# Altium schematic sheet MOTOR_CUR_SENS.SchDoc
size A; SheetNumber: 4; SheetTotal: 6
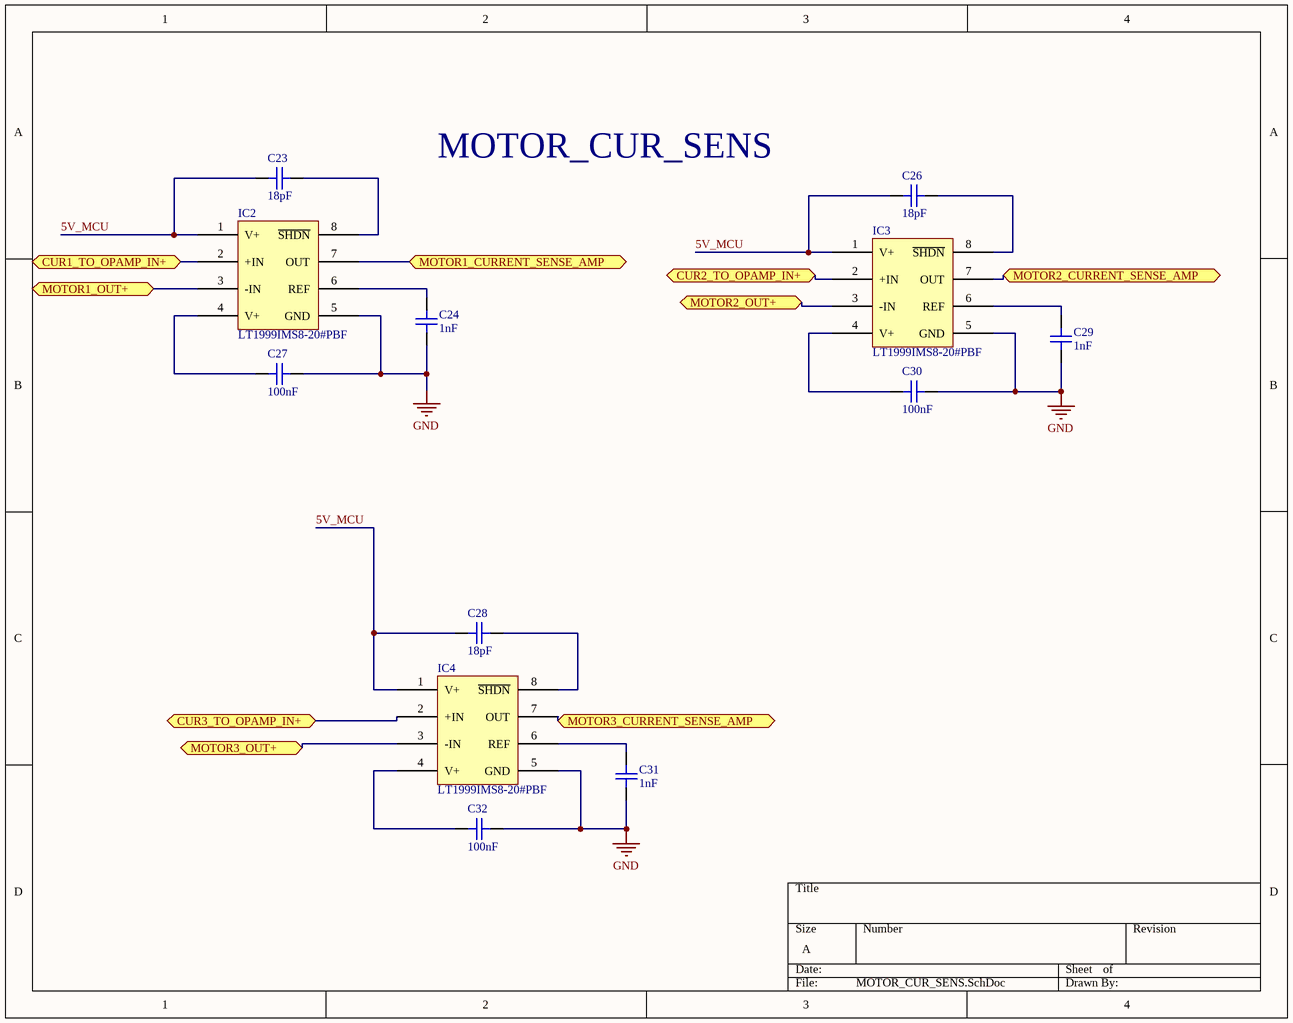
[diagram p0: MOTOR_CUR_SENS.SchDoc]

## Parts
C23  18pF  [CAP_ADJ_0805]
C24  1nF  [CAP_ADJ_0805]
C26  18pF  [CAP_ADJ_0805]
C27  100nF  [CAP_ADJ_0805]
C28  18pF  [CAP_ADJ_0805]
C29  1nF  [CAP_ADJ_0805]
C30  100nF  [CAP_ADJ_0805]
C31  1nF  [CAP_ADJ_0805]
C32  100nF  [CAP_ADJ_0805]
IC2  LT1999IMS8-20#PBF  [LT1999IMS8-20#PBF-ND]
IC3  LT1999IMS8-20#PBF  [LT1999IMS8-20#PBF-ND]
IC4  LT1999IMS8-20#PBF  [LT1999IMS8-20#PBF-ND]

## Ports
CUR1_TO_OPAMP_IN+ (bidir), CUR2_TO_OPAMP_IN+ (bidir), CUR3_TO_OPAMP_IN+ (bidir), MOTOR1_CURRENT_SENSE_AMP (bidir), MOTOR1_OUT+ (bidir), MOTOR2_CURRENT_SENSE_AMP (bidir), MOTOR2_OUT+ (bidir), MOTOR3_CURRENT_SENSE_AMP (bidir), MOTOR3_OUT+ (bidir)

## Nets
GND: C24.1 C27.1 C29.1 C30.1 C31.1 C32.1 IC2.5(GND) IC3.5(GND) IC4.5(GND)
5V_MCU: C23.2 C26.2 C28.2 IC2.1(V+) IC3.1(V+) IC4.1(V+)
CUR1_TO_OPAMP_IN+: IC2.2(+IN) ; port CUR1_TO_OPAMP_IN+
CUR2_TO_OPAMP_IN+: IC3.2(+IN) ; port CUR2_TO_OPAMP_IN+
CUR3_TO_OPAMP_IN+: IC4.2(+IN) ; port CUR3_TO_OPAMP_IN+
MOTOR1_CURRENT_SENSE_AMP: IC2.7(OUT) ; port MOTOR1_CURRENT_SENSE_AMP
MOTOR1_OUT+: IC2.3(-IN) ; port MOTOR1_OUT+
MOTOR2_CURRENT_SENSE_AMP: IC3.7(OUT) ; port MOTOR2_CURRENT_SENSE_AMP
MOTOR2_OUT+: IC3.3(-IN) ; port MOTOR2_OUT+
MOTOR3_CURRENT_SENSE_AMP: IC4.7(OUT) ; port MOTOR3_CURRENT_SENSE_AMP
MOTOR3_OUT+: IC4.3(-IN) ; port MOTOR3_OUT+
NetC23_1: C23.1 IC2.8(~{SHDN})
NetC24_2: C24.2 IC2.6(REF)
NetC26_1: C26.1 IC3.8(~{SHDN})
NetC27_2: C27.2 IC2.4(V+)
NetC28_1: C28.1 IC4.8(~{SHDN})
NetC29_2: C29.2 IC3.6(REF)
NetC30_2: C30.2 IC3.4(V+)
NetC31_2: C31.2 IC4.6(REF)
NetC32_2: C32.2 IC4.4(V+)

## Notes on the sheet
- MOTOR_CUR_SENS

## Library data of the parts
C23 C26 C28 = CAP_ADJ_0805: CERAMIC CAPACITOR SMD 0805; Manufacturer: Yageo; Manufacturer Part Number: CC0805FRNPO9BN180; Tolerance: 1%; Voltage Rating (DC): 50V; Dielectric: C0G; Supplier 1: Digi-Key; Supplier Part Number 1: 311-4168-1-ND; Stock 1: 0; Pricing 1: 1=0.24, 10=0.172, 100=0.0808, 500=0.0566, 1000=0.0469 (USD); Mount: Surface Mount; Case/Package: 0805; Weight: 0.000194oz; Case Code (Imperial): 0805; Case Code (Metric): 2012; Min Operating Temperature: -55°C; Max Operating Temperature: 125°C; Capacitance: 18pF; Packaging: Tape and Reel; Voltage Rating: 50V; Termination: SMD/SMT; Composition: Ceramic; Length: 2mm; Height: 0.6mm; Width: 0.049inch; Thickness: 0.028inch; Depth: 1.25mm; Radiation Hardening: No; Lead Free: Lead Free; ComponentLink1URL: https://datasheet.ciiva.com/17436/upy-gp-np0-16v-to-50v-8-17436806.pdf; ComponentLink1Description: https://datasheet.ciiva.com/17436/upy-gp-np0-16v-to-50v-8-17436806.pdf; ComponentLink2URL: https://datasheet.ciiva.com/13209/upy-gp-np0-16v-to-50v-8-13209403.pdf; ComponentLink2Description: https://datasheet.ciiva.com/13209/upy-gp-np0-16v-to-50v-8-13209403.pdf; ComponentLink3URL: https://datasheet.ciiva.com/11465/upy-gp-np0-16v-to-50v-8-11465132.pdf; ComponentLink3Description: https://datasheet.ciiva.com/11465/upy-gp-np0-16v-to-50v-8-11465132.pdf
C24 C29 C31 = CAP_ADJ_0805: CERAMIC CAPACITOR SMD 0805; Manufacturer: KEMET; Manufacturer Part Number: C0805C102K4RACTU; Voltage Rating: 16V; Tolerance: 10%; Dielectric: X7R; Dissipation Factor: 5%; Supplier 1: Digi-Key; Supplier Part Number 1: 399-7987-1-ND; Stock 1: 41262; Pricing 1: 1=0.1, 10=0.07, 100=0.031, 500=0.0221, 1000=0.0174 (USD); Mount: Surface Mount; Case/Package: 0805; Case Code (Metric): 2012; Case Code (Imperial): 0805; Dielectric Material: Ceramic; Min Operating Temperature: -55°C; Max Operating Temperature: 125°C; Package Quantity: 1; Capacitance: 1nF; Packaging: Tape and Reel; Voltage Rating (DC): 16V; Termination: SMD/SMT; Length: 0.079inch; Height: 0.78mm; Width: 0.049inch; Thickness: 0.035inch; Lead Pitch: 0.75mm; REACH SVHC: No SVHC; ComponentLink1URL: http://www.mouser.com/ds/2/212/KEM_C1002_X7R_SMD-1102033.pdf; ComponentLink1Description: http://www.mouser.com/ds/2/212/KEM_C1002_X7R_SMD-1102033.pdf; ComponentLink2URL: https://search.kemet.com/component-edge/download/datasheet/C0805C102K4RACTU.pdf; ComponentLink2Description: https://search.kemet.com/component-edge/download/datasheet/C0805C102K4RACTU.pdf; ComponentLink3URL: http://capacitoredge.kemet.com/capedge2/DataSheet?pn=C0805C102K4RACTU; ComponentLink3Description: http://capacitoredge.kemet.com/capedge2/DataSheet?pn=C0805C102K4RACTU
C27 C30 C32 = CAP_ADJ_0805: CERAMIC CAPACITOR SMD 0805; Manufacturer: KEMET; Manufacturer Part Number: C0805C104J5RACAUTO; Voltage Rating: 50V; Tolerance: 5%; Dielectric: X7R; Supplier 1: Digi-Key; Supplier Part Number 1: 399-6925-1-ND; Stock 1: 9661; Pricing 1: 1=0.22, 10=0.152, 100=0.0769, 500=0.0526, 1000=0.0466 (USD); Mount: Surface Mount; Case/Package: 0805; Case Code (Metric): 2012; Case Code (Imperial): 0805; Dielectric Material: Ceramic; Min Operating Temperature: -55°C; Max Operating Temperature: 125°C; Package Quantity: 1; Capacitance: 100nF; Packaging: Cut Tape; Voltage Rating (DC): 50V; Length: 0.079inch; Width: 0.049inch; Thickness: 0.035inch; Depth: 1.25mm; REACH SVHC: No SVHC; ComponentLink1URL: http://components.arrow.com/part/dataview/0323_00324161; ComponentLink1Description: http://components.arrow.com/part/dataview/0323_00324161; ComponentLink2URL: http://www.farnell.com/datasheets/2123421.pdf; ComponentLink2Description: http://www.farnell.com/datasheets/2123421.pdf; ComponentLink3URL: https://search.kemet.com/component-edge/download/datasheet/C0805C104J5RACAUTO.pdf; ComponentLink3Description: https://search.kemet.com/component-edge/download/datasheet/C0805C104J5RACAUTO.pdf
IC2-IC4 = LT1999IMS8-20#PBF: IC OPAMP CURR SENSE 2MHZ 8MSOP; Manufacturer: Analog Devices / Linear Technology; Nominal Supply Current: 5.8mA; Common Mode Rejection Ratio: 75dB; Number of Channels: 1; Max Supply Voltage: 5.5V; Min Supply Voltage: 4.5V; Operating Supply Voltage: 5V; Slew Rate: 3V/µs; Input Bias Current: 137.5uA; Input Offset Voltage (Vos): 1.5mV; Output Current per Channel: 40mA; Number of Amplifiers: 2; Power Supply Rejection Ratio (PSRR): 68dB; Voltage Gain: 26.06dB; Input Resistance: 20MR; Supplier 1: Digi-Key; Manufacturer Part Number: LT1999IMS8-20#PBF; Stock 1: 1084; Pricing 1: 1=4.69, 25=3.114, 100=2.5704 (USD); Mount: Surface Mount; Case/Package: MSOP; Number of Pins: 8; Min Operating Temperature: -40°C; Max Operating Temperature: 85°C; Bandwidth: 2MHz; Package Quantity: 50; -3db Bandwidth: 2MHz; Packaging: Rail/Tube; Number of Circuits: 1; Operating Supply Current: 5.8mA; Number of Elements: 2; Radiation Hardening: No; REACH SVHC: No SVHC; ComponentLink1URL: https://datasheet.ciiva.com/1492/1712294-1492547.pdf; ComponentLink1Description: https://datasheet.ciiva.com/1492/1712294-1492547.pdf; ComponentLink2URL: https://datasheet.ciiva.com/15129/getdatasheetpartid-480250-15129031.pdf; ComponentLink2Description: https://datasheet.ciiva.com/15129/getdatasheetpartid-480250-15129031.pdf; ComponentLink3URL: https://datasheet.ciiva.com/14152/lt1999-eng-ds-14152393.pdf; ComponentLink3Description: https://datasheet.ciiva.com/14152/lt1999-eng-ds-14152393.pdf; ComponentLink4URL: https://datasheet.ciiva.com/1794/30000-1794699.pdf; ComponentLink4Description: https://datasheet.ciiva.com/1794/30000-1794699.pdf; Supplier Part Number 1: LT1999IMS8-20#PBF-ND